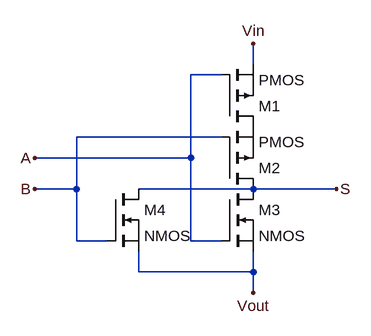
[diagram p0: schematic NOR.asc]
NOR.asc, the LTspice schematic file:
Version 4
SHEET 1 880 680
WIRE 288 32 288 0
WIRE 240 48 192 48
WIRE 240 144 16 144
WIRE 192 176 192 48
WIRE 192 176 -48 176
WIRE 16 224 16 144
WIRE 16 224 -48 224
WIRE 288 224 112 224
WIRE 416 224 288 224
WIRE 16 304 16 224
WIRE 64 304 16 304
WIRE 192 304 192 176
WIRE 240 304 192 304
WIRE 112 352 112 320
WIRE 288 352 288 320
WIRE 288 352 112 352
WIRE 288 384 288 352
FLAG 288 0 Vin
FLAG -48 176 A
FLAG -48 224 B
FLAG 416 224 S
FLAG 288 384 Vout
SYMBOL pmos 240 128 M180
SYMATTR InstName M1
SYMBOL pmos 240 224 M180
SYMATTR InstName M2
SYMBOL nmos 240 224 R0
SYMATTR InstName M3
SYMBOL nmos 64 224 R0
SYMATTR InstName M4

The netlist it stands for:
* NOR.asc
M1 P001 A Vin Vin PMOS
M2 S B P001 P001 PMOS
M3 S A Vout Vout NMOS
M4 S B Vout Vout NMOS
.model NMOS NMOS
.model PMOS PMOS
.lib standard.mos
.backanno
.end